# EAGLE schematic XMICRO-MEMORY (EAGLE 6.3)
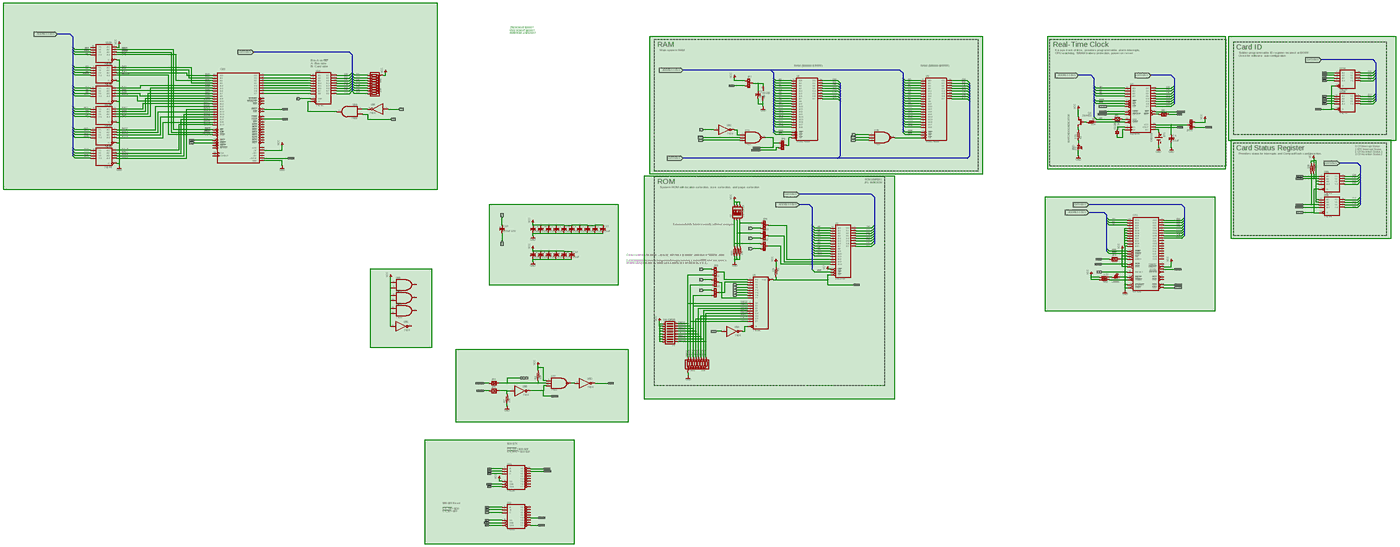
[diagram p0: schematic, sheet 1, overview]
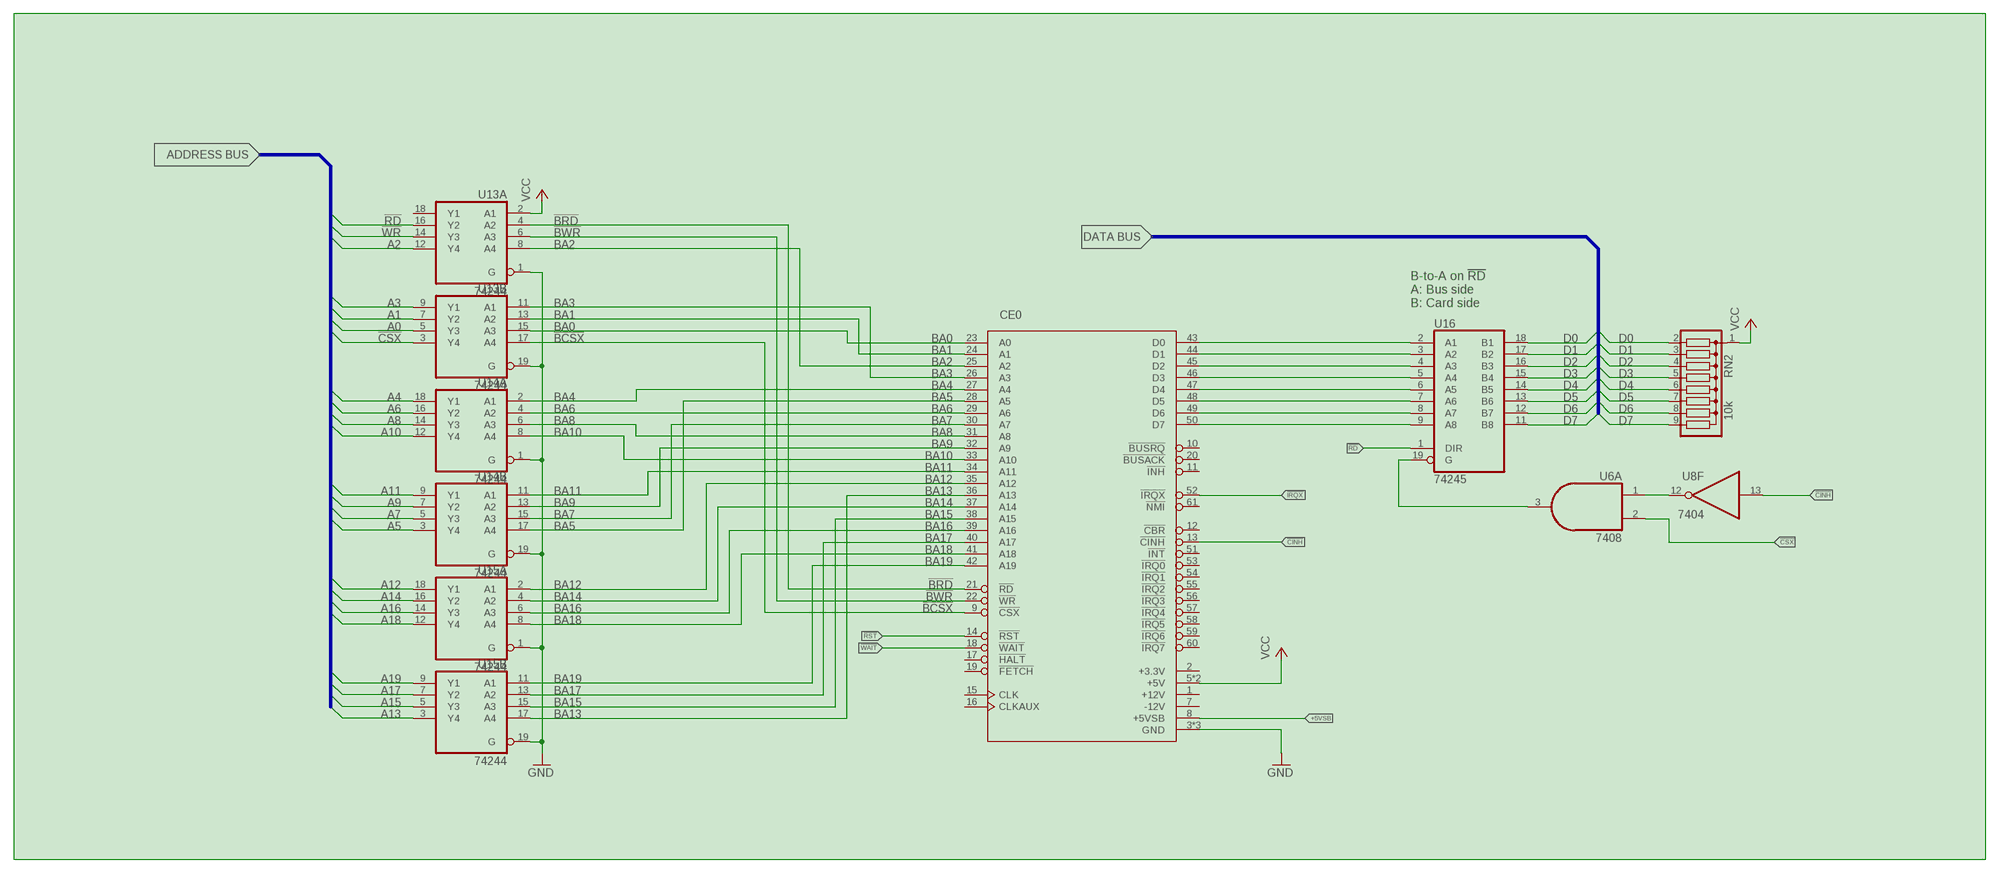
[diagram p1: schematic, sheet 1, part 1 of 6]
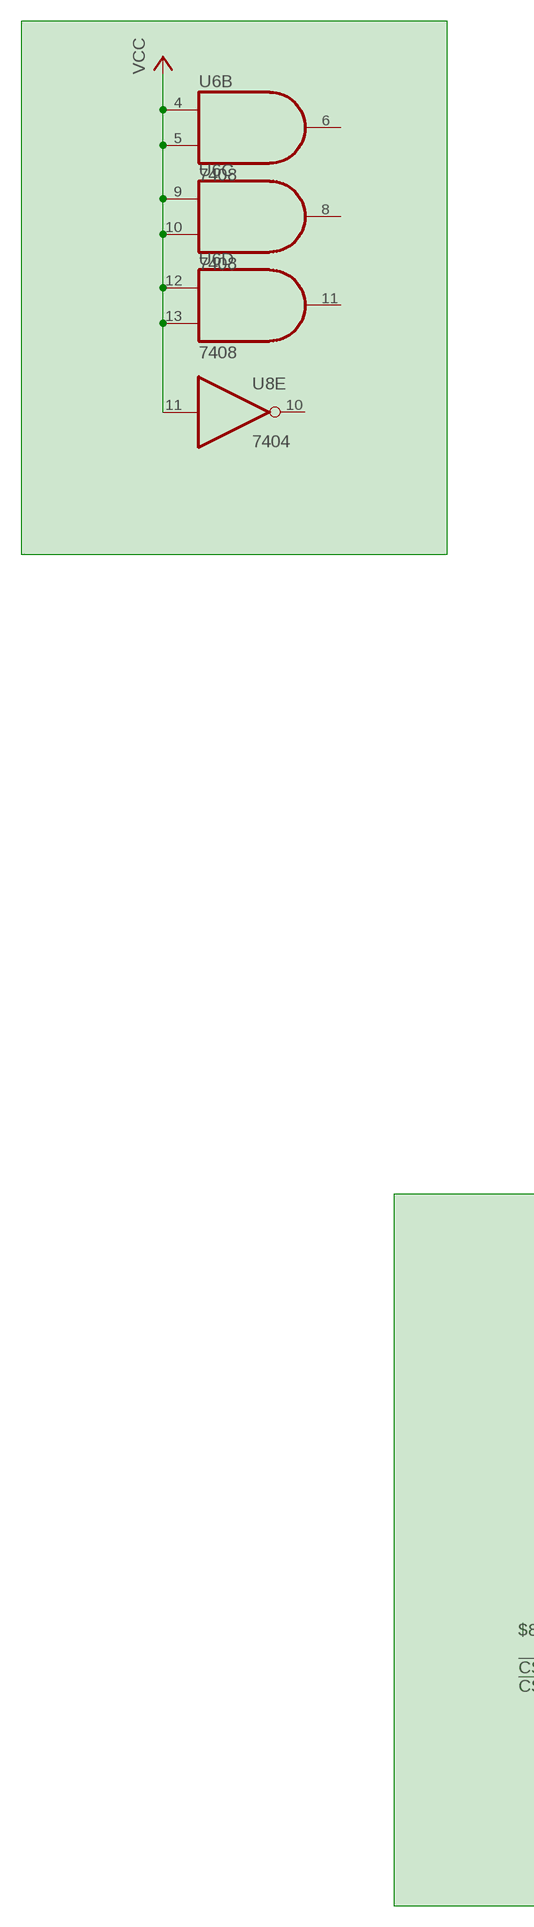
[diagram p2: schematic, sheet 1, part 2 of 6]
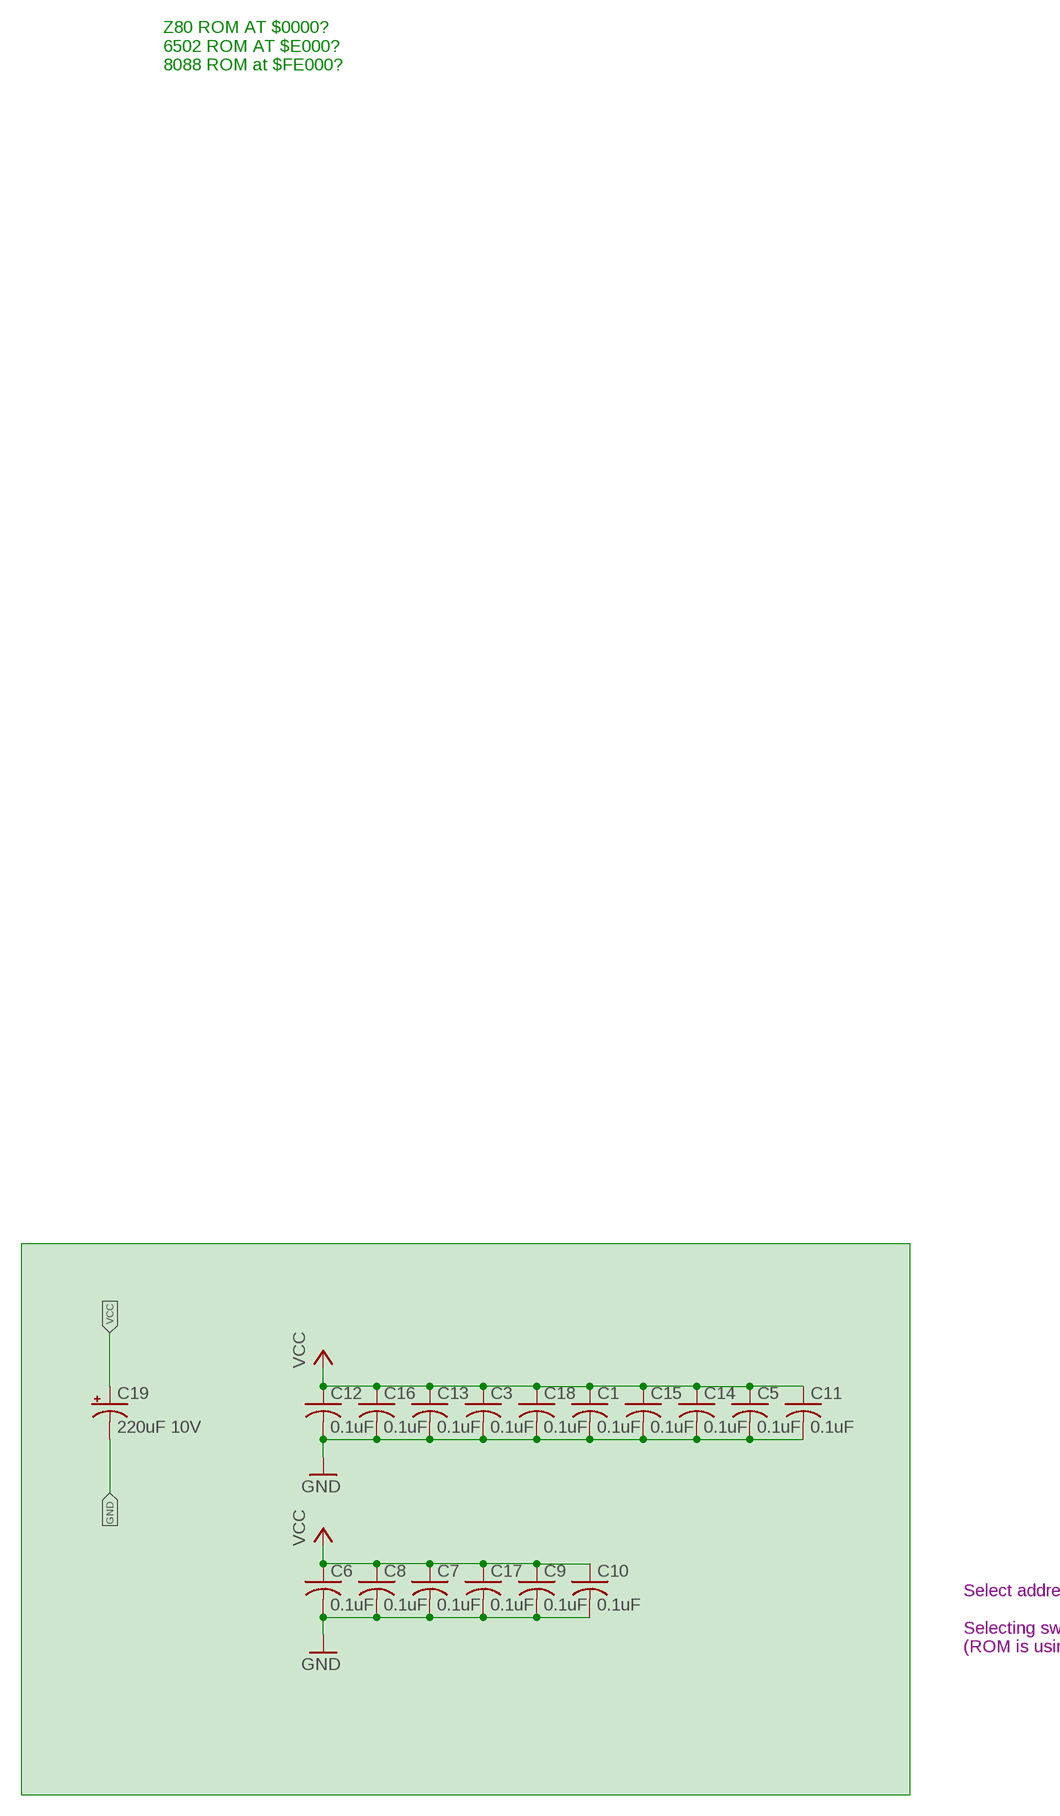
[diagram p3: schematic, sheet 1, part 3 of 6]
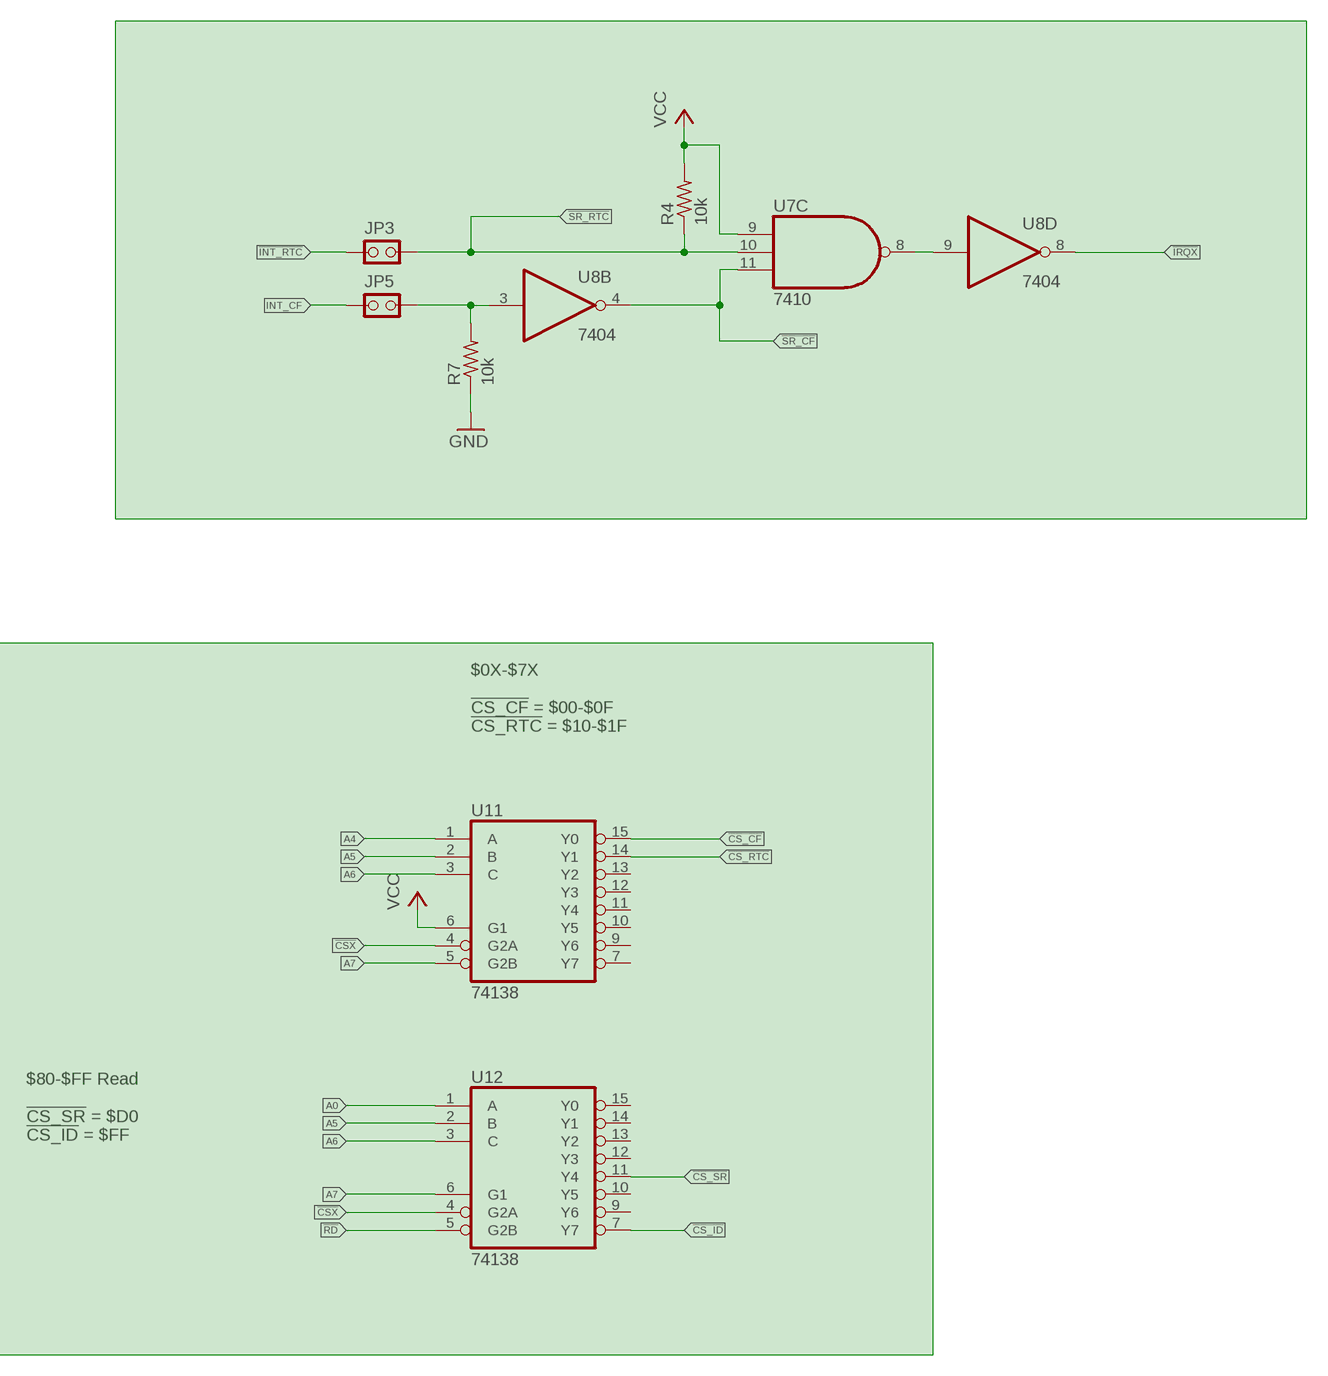
[diagram p4: schematic, sheet 1, part 4 of 6]
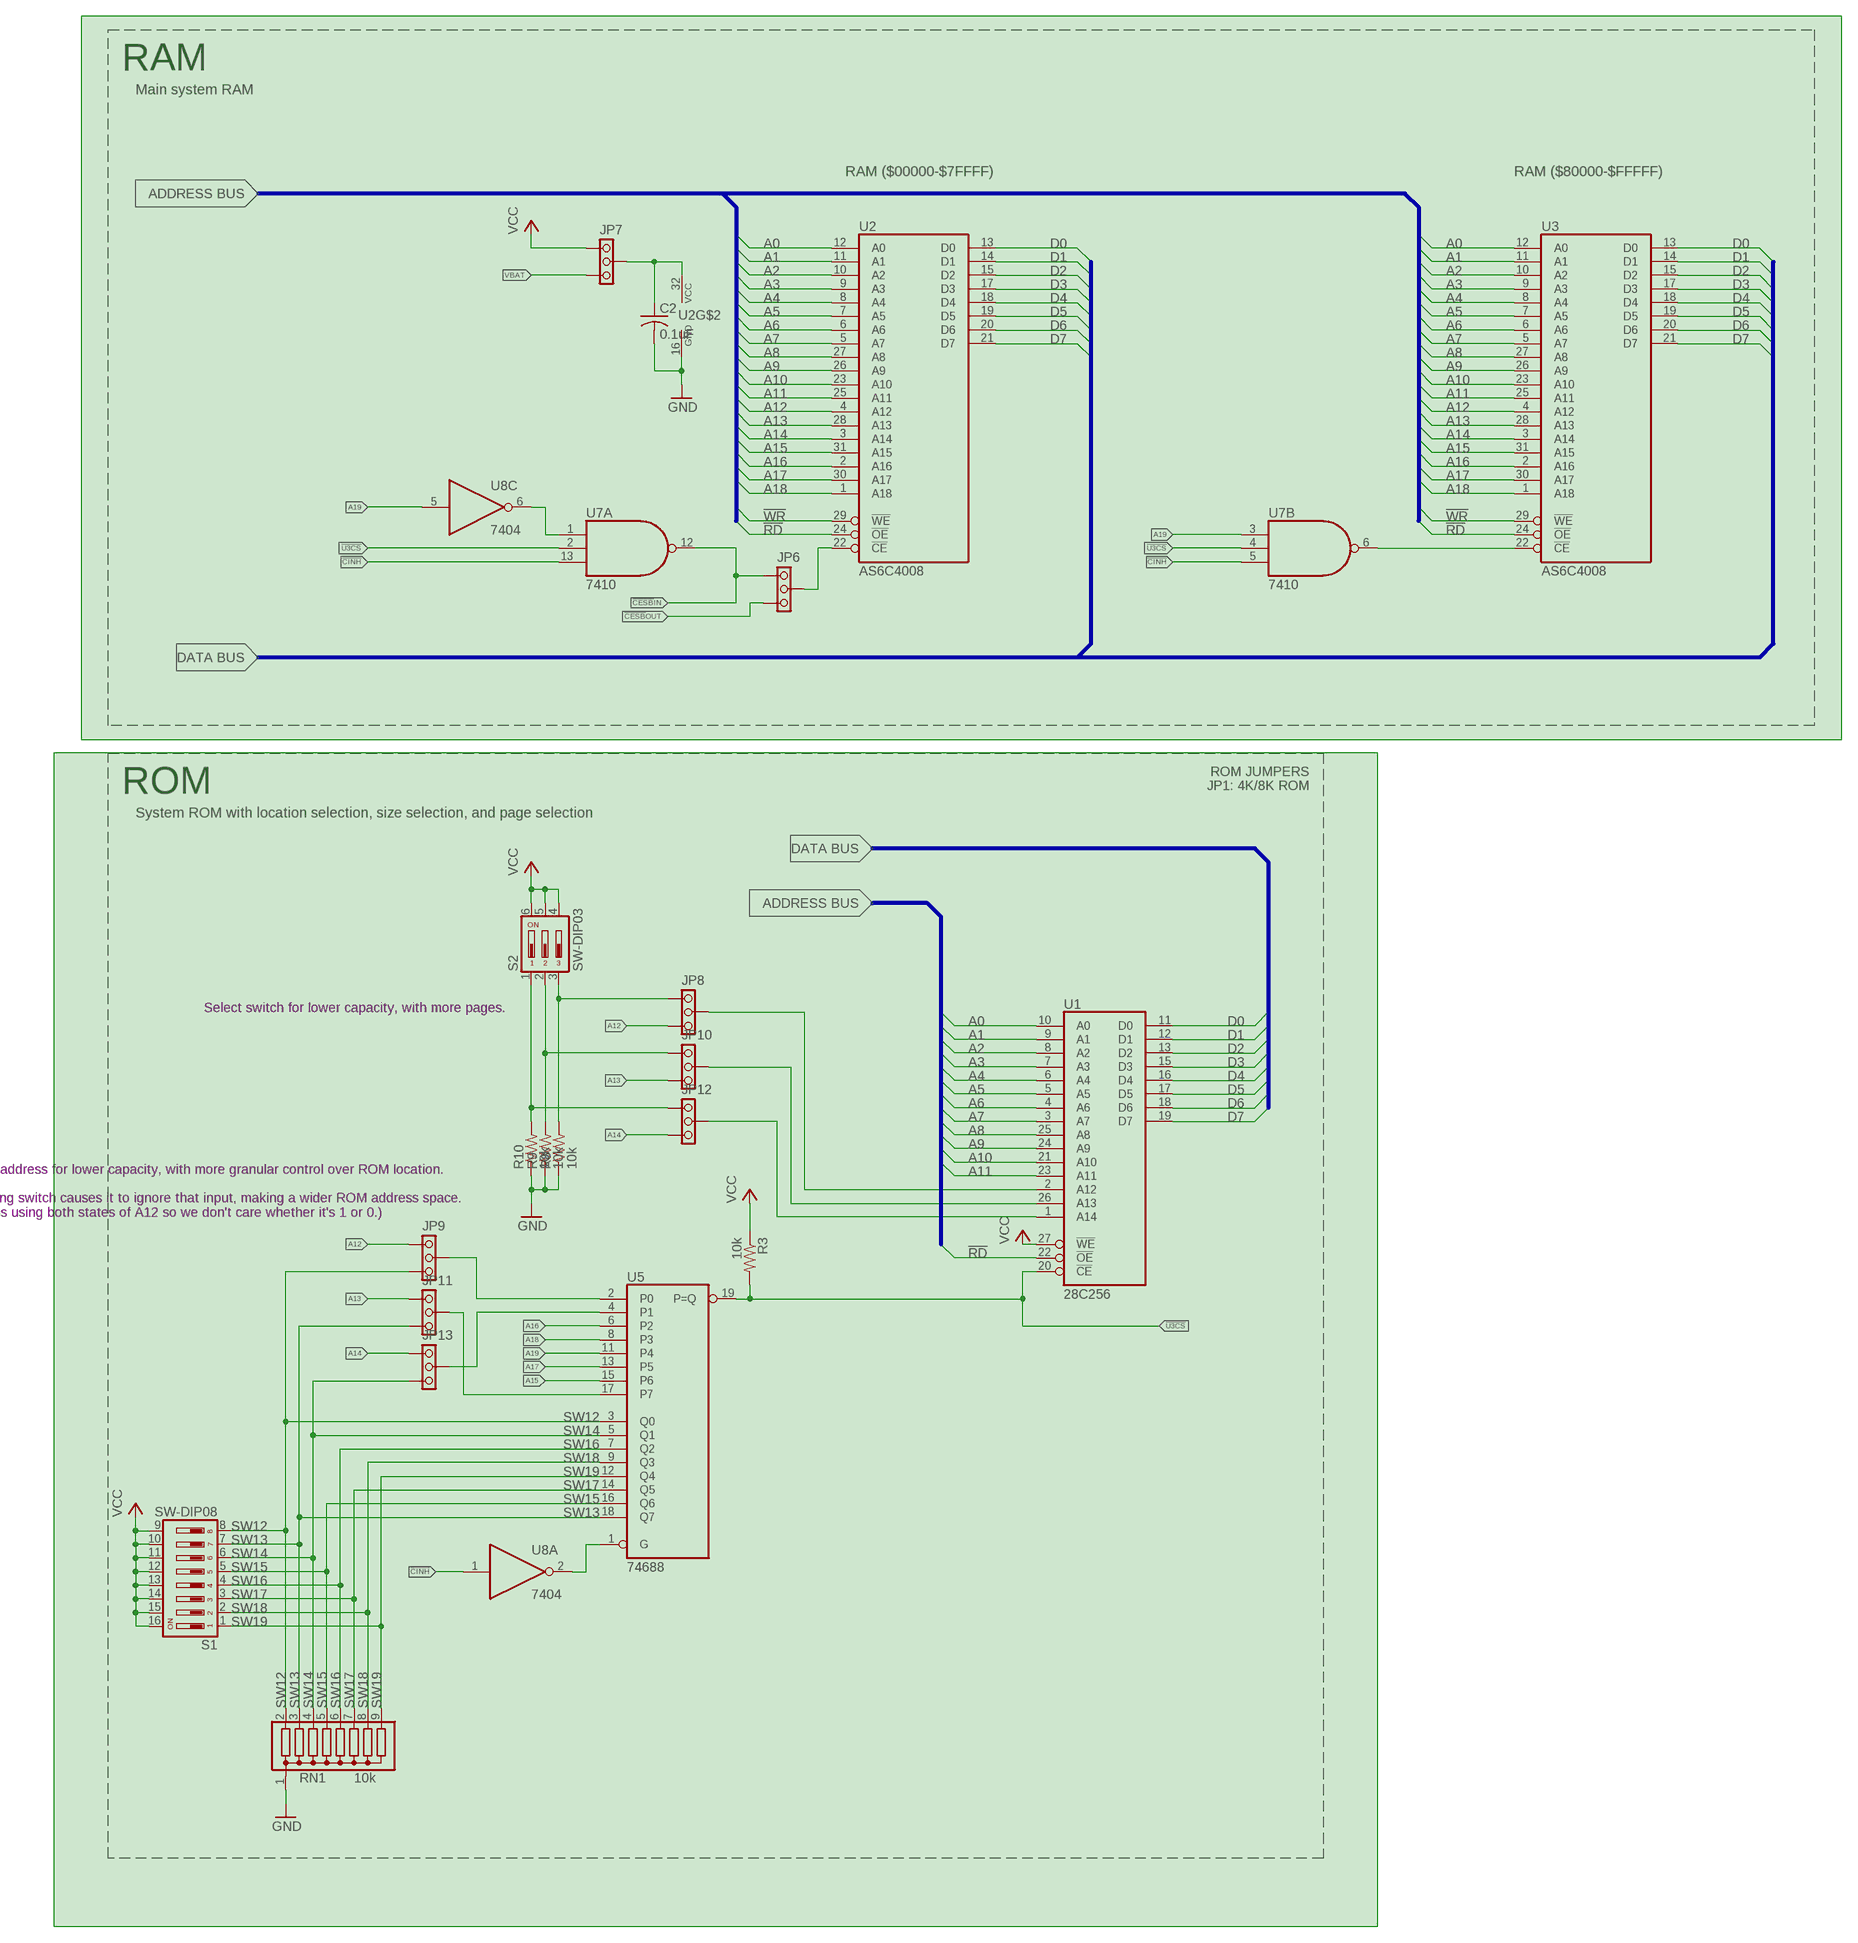
[diagram p5: schematic, sheet 1, part 5 of 6]
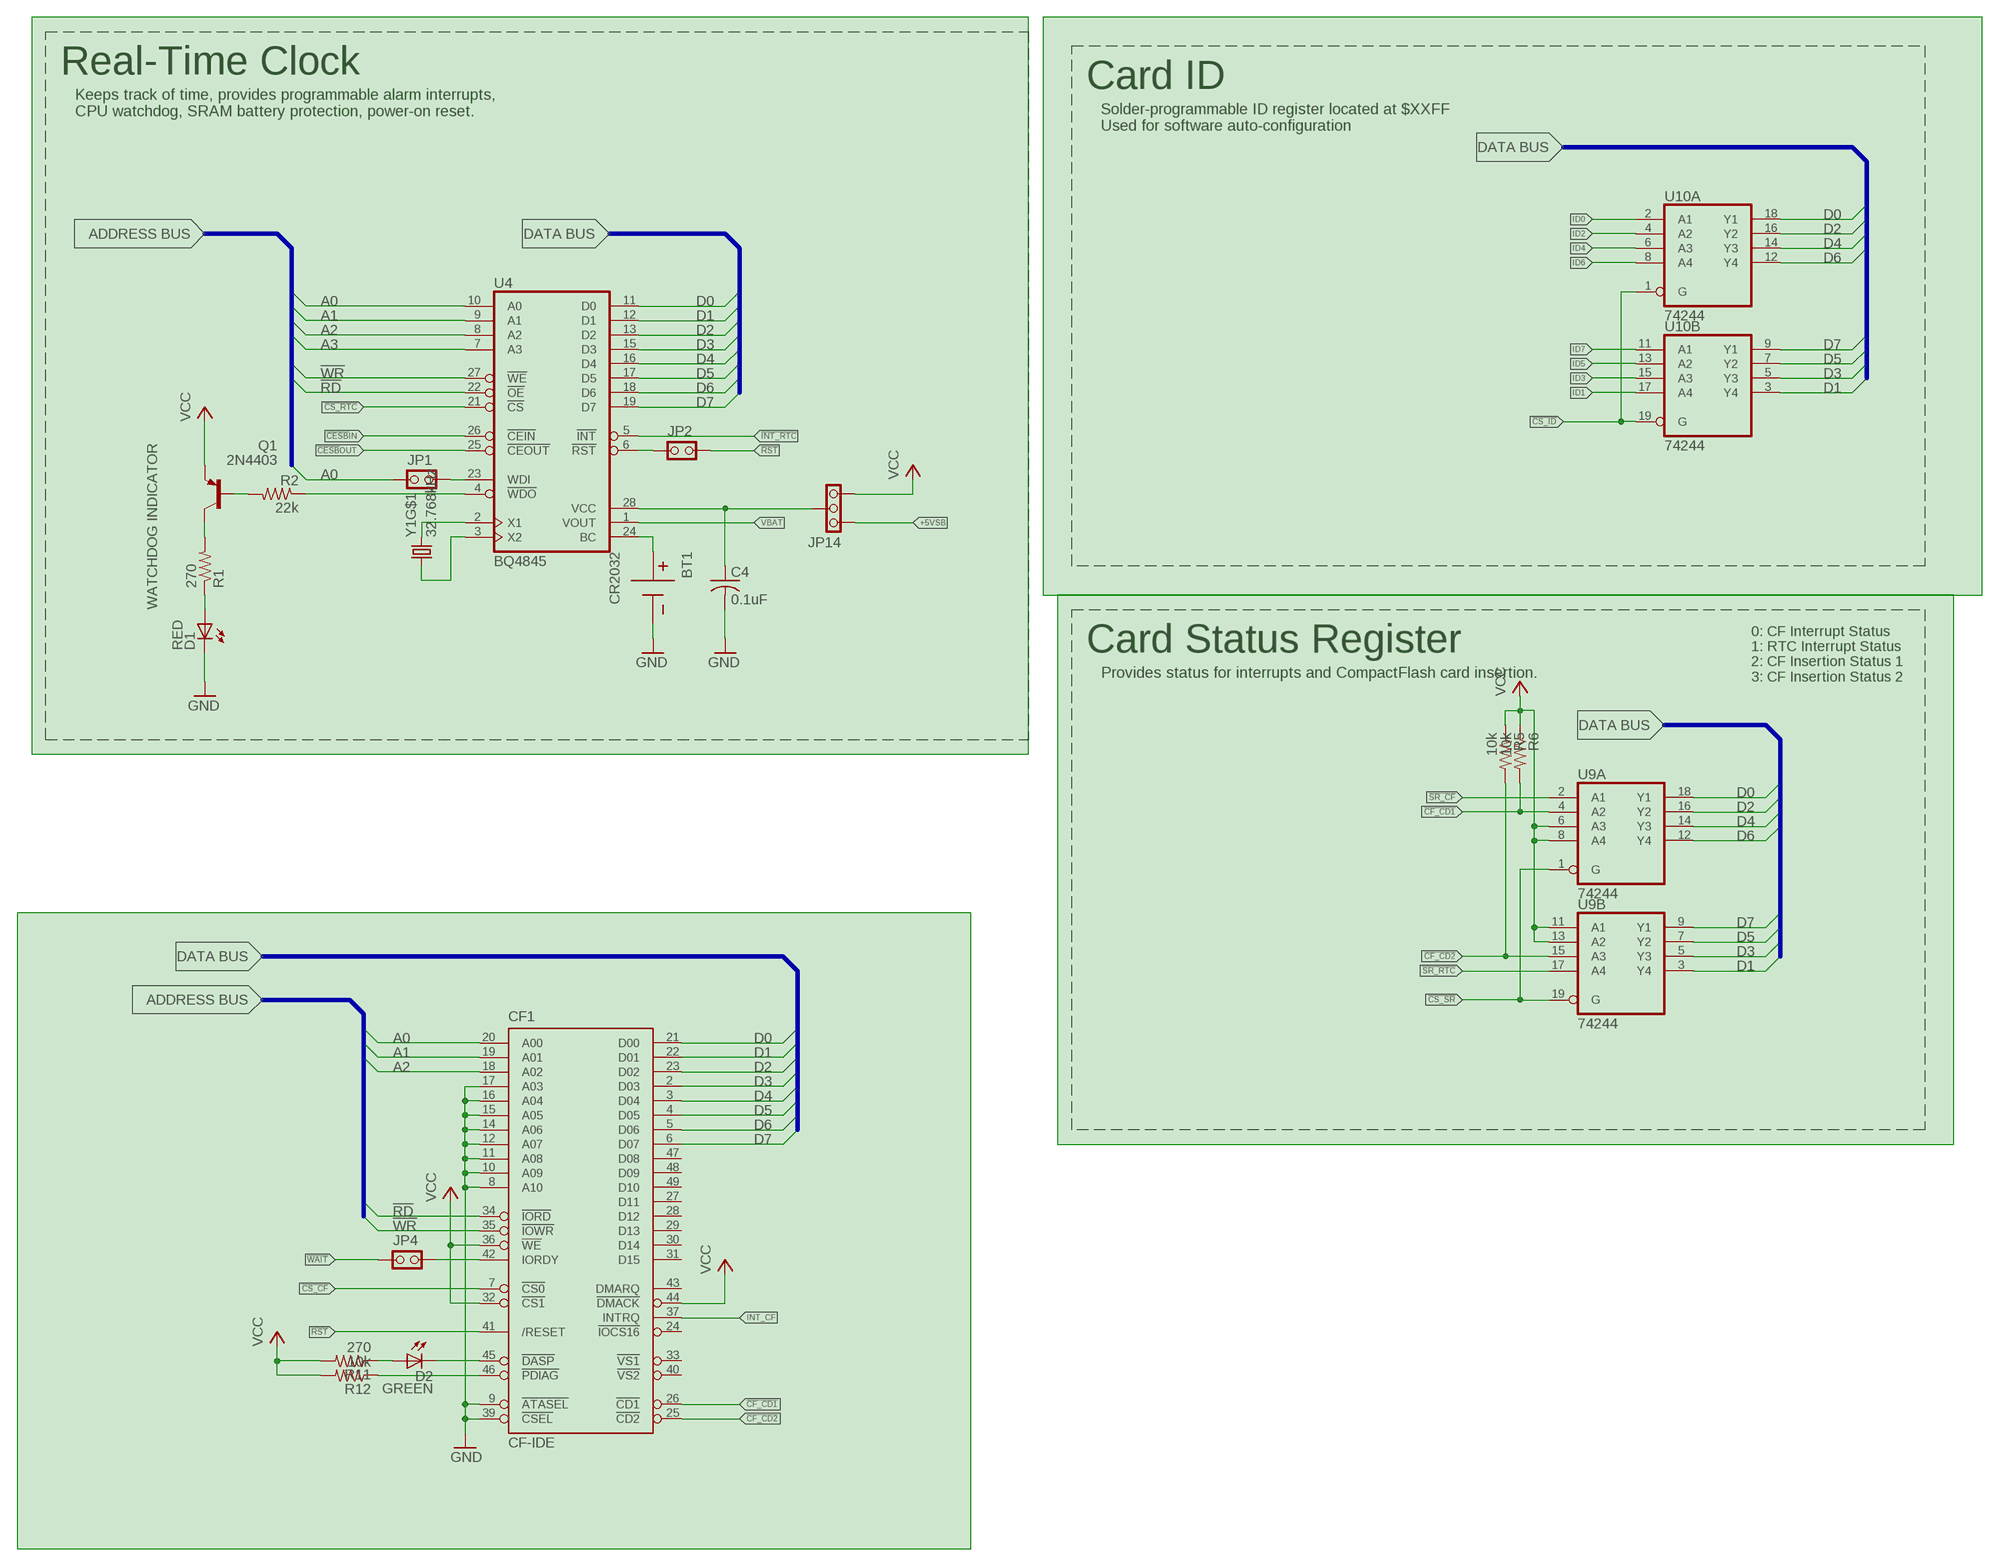
[diagram p6: schematic, sheet 1, part 6 of 6]

## Parts
BT1  CR2032  CR2032SMT  [SMTU2032]
C1  0.1uF  C-US025-024X044  [C025-024X044]
C2  0.1uF  C-US025-024X044  [C025-024X044]
C3  0.1uF  C-US025-024X044  [C025-024X044]
C4  0.1uF  C-US025-024X044  [C025-024X044]
C5  0.1uF  C-US025-024X044  [C025-024X044]
C6  0.1uF  C-US025-024X044  [C025-024X044]
C7  0.1uF  C-US025-024X044  [C025-024X044]
C8  0.1uF  C-US025-024X044  [C025-024X044]
C9  0.1uF  C-US025-024X044  [C025-024X044]
C10  0.1uF  C-US025-024X044  [C025-024X044]
C11  0.1uF  C-US025-024X044  [C025-024X044]
C12  0.1uF  C-US025-024X044  [C025-024X044]
C13  0.1uF  C-US025-024X044  [C025-024X044]
C14  0.1uF  C-US025-024X044  [C025-024X044]
C15  0.1uF  C-US025-024X044  [C025-024X044]
C16  0.1uF  C-US025-024X044  [C025-024X044]
C17  0.1uF  C-US025-024X044  [C025-024X044]
C18  0.1uF  C-US025-024X044  [C025-024X044]
C19  220uF 10V  CPOL-US-10-5  [C-10-5]
CE0  XMICRO-BUS-EDGE62M  [EDGE62M]
CF1  CF-IDE  [CF-KYOCERA]
D1  RED  LED5MM  [LED5MM]
D2  GREEN  LED-3-R  [LED-3-R]
JP1  PINHD-1X2THRU  [1X02]
JP2  PINHD-1X2THRU  [1X02]
JP3  PINHD-1X2THRU  [1X02]
JP4  PINHD-1X2THRU  [1X02]
JP5  PINHD-1X2THRU  [1X02]
JP6  PINHD1X3THRU  [1X03]
JP7  PINHD1X3THRU  [1X03]
JP8  PINHD1X3THRU  [1X03]
JP9  PINHD1X3THRU  [1X03]
JP10  PINHD1X3THRU  [1X03]
JP11  PINHD1X3THRU  [1X03]
JP12  PINHD1X3THRU  [1X03]
JP13  PINHD1X3THRU  [1X03]
JP14  PINHD1X3THRU  [1X03]
Q1  2N4403  TRANSISTOR-PNP-2N4403  [TO92]
R1  270  R-US_0207/10  [0207/10]
R2  22k  R-US_0207/10  [0207/10]
R3  10k  R-US_0207/10  [0207/10]
R4  10k  R-US_0207/10  [0207/10]
R5  10k  R-US_0207/10  [0207/10]
R6  10k  R-US_0207/10  [0207/10]
R7  10k  R-US_0207/10  [0207/10]
R8  10k  R-US_0207/10  [0207/10]
R9  10k  R-US_0207/10  [0207/10]
R10  10k  R-US_0207/10  [0207/10]
R11  270  R-US_0207/10  [0207/10]
R12  10k  R-US_0207/10  [0207/10]
RN1  10k  G08R  [SIL9]
RN2  10k  G08R  [SIL9]
S1  SW-DIP08  [SW-DIP8]
S2  SW-DIP03  [SW-DIP3]
U1  28C256  28256-ZIF28  [228-1277-00]
U2  AS6C4008  4008  [DIL32-6]
U3  AS6C4008  4008  [DIL32-6]
U4  BQ4845  [DIL28]
U5  74688  74LS688N  [DIL20]
U6  7408  74LS08N  [DIL14]
U7  7410  74LS10N  [DIL14]
U8  7404  74LS04N  [DIL14]
U9  74244  74LS244N  [DIL20]
U10  74244  74LS244N  [DIL20]
U11  74138  74LS138N  [DIL16]
U12  74138  74LS138N  [DIL16]
U13  74244  74LS244N  [DIL20]
U14  74244  74LS244N  [DIL20]
U15  74244  74LS244N  [DIL20]
U16  74245  74LS245N  [DIL20]
Y1  32.768kHz  CRYSTAL  [CRYSTAL-3X8H]

## Nets
!BCSX: CE0.9(!CSX) U13.17(B:A4)
!BRD: CE0.21(!RD) U13.4(A:A2)
!BWR: CE0.22(!WR) U13.6(A:A3)
!CESB!IN: JP6.1 U4.26(!CEIN) U7.12(A:O)
!CESB!OUT: JP6.3 U4.25(!CEOUT)
!CF_CD1: CF1.26(!CD1) R6.2 U9.4(A:A2)
!CF_CD2: CF1.25(!CD2) R5.2 U9.15(B:A3)
!CINH: CE0.13(!CINH) U7.5(B:I2) U7.13(A:I2) U8.1(A:I) U8.13(F:I)
!CS_CF: CF1.7(!CS0) U11.15(Y0)
!CS_ID: U10.1(A:G) U10.19(B:G) U12.7(Y7)
!CS_RTC: U4.21(!CS) U11.14(Y1)
!CS_SR: U9.1(A:G) U9.19(B:G) U12.11(Y4)
!CSX: U6.2(A:I1) U11.4(G2A) U12.4(G2A) U13.3(B:Y4)
!INT_RTC: JP3.1 U4.5(!INT)
!IRQX: CE0.52(!IRQX) U8.8(D:O)
!RD: CF1.34(!IORD) U1.22(!OE) U2.24(!OE) U3.24(!OE) U4.22(!OE) U12.5(G2B) U13.16(A:Y2) U16.1(DIR)
!RST: CE0.14(!RST) CF1.41(/RESET) JP2.2
!SR_CF: U7.11(C:I2) U8.4(B:O) U9.2(A:A1)
!SR_RTC: JP3.2 R4.1 U7.10(C:I1) U9.17(B:A4)
!U1CS: JP6.2 U2.22(!CE)
!U2CS: U3.22(!CE) U7.6(B:O)
!U3CS: R3.2 U1.20(!CE) U5.19(P=Q) U7.2(A:I1) U7.4(B:I1)
!WAIT: CE0.18(!WAIT) JP4.1
!WR: CF1.35(!IOWR) U2.29(!WE) U3.29(!WE) U4.27(!WE) U13.14(A:Y3)
+5VSB: CE0.8(+5VSB) JP14.1
A0: CF1.20(A00) JP1.1 U1.10(A0) U2.12(A0) U3.12(A0) U4.10(A0) U12.1(A) U13.5(B:Y3)
A1: CF1.19(A01) U1.9(A1) U2.11(A1) U3.11(A1) U4.9(A1) U13.7(B:Y2)
A2: CF1.18(A02) U1.8(A2) U2.10(A2) U3.10(A2) U4.8(A2) U13.12(A:Y4)
A3: U1.7(A3) U2.9(A3) U3.9(A3) U4.7(A3) U13.9(B:Y1)
A4: U1.6(A4) U2.8(A4) U3.8(A4) U11.1(A) U14.18(A:Y1)
A5: U1.5(A5) U2.7(A5) U3.7(A5) U11.2(B) U12.2(B) U14.3(B:Y4)
A6: U1.4(A6) U2.6(A6) U3.6(A6) U11.3(C) U12.3(C) U14.16(A:Y2)
A7: U1.3(A7) U2.5(A7) U3.5(A7) U11.5(G2B) U12.6(G1) U14.5(B:Y3)
A8: U1.25(A8) U2.27(A8) U3.27(A8) U14.14(A:Y3)
A9: U1.24(A9) U2.26(A9) U3.26(A9) U14.7(B:Y2)
A10: U1.21(A10) U2.23(A10) U3.23(A10) U14.12(A:Y4)
A11: U1.23(A11) U2.25(A11) U3.25(A11) U14.9(B:Y1)
A12: JP8.3 JP9.1 U2.4(A12) U3.4(A12) U15.18(A:Y1)
A13: JP10.3 JP11.1 U2.28(A13) U3.28(A13) U15.3(B:Y4)
A14: JP12.3 JP13.1 U2.3(A14) U3.3(A14) U15.16(A:Y2)
A15: U2.31(A15) U3.31(A15) U5.15(P6) U15.5(B:Y3)
A16: U2.2(A16) U3.2(A16) U5.6(P2) U15.14(A:Y3)
A17: U2.30(A17) U3.30(A17) U5.13(P5) U15.7(B:Y2)
A18: U2.1(A18) U3.1(A18) U5.8(P3) U15.12(A:Y4)
A19: U5.11(P4) U7.3(B:I0) U8.5(C:I) U15.9(B:Y1)
BA0: CE0.23(A0) U13.15(B:A3)
BA1: CE0.24(A1) U13.13(B:A2)
BA2: CE0.25(A2) U13.8(A:A4)
BA3: CE0.26(A3) U13.11(B:A1)
BA4: CE0.27(A4) U14.2(A:A1)
BA5: CE0.28(A5) U14.17(B:A4)
BA6: CE0.29(A6) U14.4(A:A2)
BA7: CE0.30(A7) U14.15(B:A3)
BA8: CE0.31(A8) U14.6(A:A3)
BA9: CE0.32(A9) U14.13(B:A2)
BA10: CE0.33(A10) U14.8(A:A4)
BA11: CE0.34(A11) U14.11(B:A1)
BA12: CE0.35(A12) U15.2(A:A1)
BA13: CE0.36(A13) U15.17(B:A4)
BA14: CE0.37(A14) U15.4(A:A2)
BA15: CE0.38(A15) U15.15(B:A3)
BA16: CE0.39(A16) U15.6(A:A3)
BA17: CE0.40(A17) U15.13(B:A2)
BA18: CE0.41(A18) U15.8(A:A4)
BA19: CE0.42(A19) U15.11(B:A1)
D0: CF1.21(D00) RN2.2 U1.11(D0) U2.13(D0) U3.13(D0) U4.11(D0) U9.18(A:Y1) U10.18(A:Y1) U16.18(B1)
D1: CF1.22(D01) RN2.3 U1.12(D1) U2.14(D1) U3.14(D1) U4.12(D1) U9.3(B:Y4) U10.3(B:Y4) U16.17(B2)
D2: CF1.23(D02) RN2.4 U1.13(D2) U2.15(D2) U3.15(D2) U4.13(D2) U9.16(A:Y2) U10.16(A:Y2) U16.16(B3)
D3: CF1.2(D03) RN2.5 U1.15(D3) U2.17(D3) U3.17(D3) U4.15(D3) U9.5(B:Y3) U10.5(B:Y3) U16.15(B4)
D4: CF1.3(D04) RN2.6 U1.16(D4) U2.18(D4) U3.18(D4) U4.16(D4) U9.14(A:Y3) U10.14(A:Y3) U16.14(B5)
D5: CF1.4(D05) RN2.7 U1.17(D5) U2.19(D5) U3.19(D5) U4.17(D5) U9.7(B:Y2) U10.7(B:Y2) U16.13(B6)
D6: CF1.5(D06) RN2.8 U1.18(D6) U2.20(D6) U3.20(D6) U4.18(D6) U9.12(A:Y4) U10.12(A:Y4) U16.12(B7)
D7: CF1.6(D07) RN2.9 U1.19(D7) U2.21(D7) U3.21(D7) U4.19(D7) U9.9(B:Y1) U10.9(B:Y1) U16.11(B8)
GND [GND]: BT1.- C1.2 C2.2 C3.2 C4.2 C5.2 C6.2 C7.2 C8.2 C9.2 C10.2 C11.2 C12.2 C13.2 C14.2 C15.2 C16.2 C17.2 C18.2 C19.- CE0.3(GND) CE0.4(GND) CE0.62(GND) CF1.8(A10) CF1.9(!ATASEL) CF1.10(A09) CF1.11(A08) CF1.12(A07) CF1.14(A06) CF1.15(A05) CF1.16(A04) CF1.17(A03) CF1.39(!CSEL) D1.K(C) R7.1 R8.1 R9.1 R10.1 RN1.1 U2.16(GND) U13.1(A:G) U13.19(B:G) U14.1(A:G) U14.19(B:G) U15.1(A:G) U15.19(B:G)
ID0: U10.2(A:A1)
ID1: U10.17(B:A4)
ID2: U10.4(A:A2)
ID3: U10.15(B:A3)
ID4: U10.6(A:A3)
ID5: U10.13(B:A2)
ID6: U10.8(A:A4)
ID7: U10.11(B:A1)
INT_CF: CF1.37(INTRQ) JP5.1
N$1: CF1.45(!DASP) D2.C
N$2: D2.A R11.1
N$3: CF1.42(IORDY) JP4.2
N$4: U5.1(G) U8.2(A:O)
N$5: U4.3(X2) Y1.1
N$6: U4.2(X1) Y1.2
N$7: BT1.+ U4.24(BC)
N$8: Q1.2(B) R2.2
N$9: C2.1 JP7.2 U2.32(VCC)
N$10: Q1.3(C) R1.2
N$11: JP1.2 U4.23(WDI)
N$12: JP10.2 U1.26(A13)
N$13: D1.A R1.1
N$14: R2.1 U4.4(!WDO)
N$16: JP8.2 U1.2(A12)
N$17: JP12.2 U1.1(A14)
N$18: JP13.2 U5.4(P1)
N$19: U7.8(C:O) U8.9(D:I)
N$20: U6.1(A:I0) U8.12(F:O)
N$21: JP5.2 R7.2 U8.3(B:I)
N$22: JP11.2 U5.17(P7)
N$23: JP9.2 U5.2(P0)
N$24: C4.1 JP14.2 U4.28(VCC)
N$25: CF1.46(!PDIAG) R12.1
N$27: U7.1(A:I0) U8.6(C:O)
N$31: JP2.1 U4.6(!RST)
N$32: U6.3(A:O) U16.19(G)
N$33: CE0.50(D7) U16.9(A8)
N$34: CE0.49(D6) U16.8(A7)
N$35: CE0.48(D5) U16.7(A6)
N$36: CE0.47(D4) U16.6(A5)
N$37: CE0.46(D3) U16.5(A4)
N$38: CE0.45(D2) U16.4(A3)
N$39: CE0.44(D1) U16.3(A2)
N$40: CE0.43(D0) U16.2(A1)
N$108: JP8.1 R8.2 S2.3
N$109: JP10.1 R9.2 S2.2
N$110: JP12.1 R10.2 S2.1
SW12: JP9.3 RN1.2 S1.8 U5.3(Q0)
SW13: JP11.3 RN1.3 S1.7 U5.18(Q7)
SW14: JP13.3 RN1.4 S1.6 U5.5(Q1)
SW15: RN1.5 S1.5 U5.16(Q6)
SW16: RN1.6 S1.4 U5.7(Q2)
SW17: RN1.7 S1.3 U5.14(Q5)
SW18: RN1.8 S1.2 U5.9(Q3)
SW19: RN1.9 S1.1 U5.12(Q4)
VBAT: JP7.3 U4.1(VOUT)
VCC: C1.1 C3.1 C5.1 C6.1 C7.1 C8.1 C9.1 C10.1 C11.1 C12.1 C13.1 C14.1 C15.1 C16.1 C17.1 C18.1 C19.+ CE0.5(+5V) CE0.6(+5V) CF1.32(!CS1) CF1.36(!WE) CF1.44(!DMACK) JP7.1 JP14.3 Q1.1(E) R3.1 R4.2 R5.1 R6.1 R11.2 R12.2 RN2.1 S1.9 S1.10 S1.11 S1.12 S1.13 S1.14 S1.15 S1.16 S2.4 S2.5 S2.6 U1.27(!WE) U6.4(B:I0) U6.5(B:I1) U6.9(C:I0) U6.10(C:I1) U6.12(D:I0) U6.13(D:I1) U7.9(C:I0) U8.11(E:I) U9.6(A:A3) U9.8(A:A4) U9.11(B:A1) U9.13(B:A2) U11.6(G1) U13.2(A:A1)
Unconnected: CE0.1(+12V) CE0.2(+3.3V) CE0.7(-12V) CE0.10(!BUSRQ) CE0.11(!INH) CE0.12(!CBR) CE0.15(CLK) CE0.16(CLKAUX) CE0.17(!HALT) CE0.19(!FETCH) CE0.20(!BUSACK) CE0.51(!INT) CE0.53(!IRQ0) CE0.54(!IRQ1) CE0.55(!IRQ2) CE0.56(!IRQ3) CE0.57(!IRQ4) CE0.58(!IRQ5) CE0.59(!IRQ6) CE0.60(!IRQ7) CE0.61(!NMI) CF1.24(!IOCS16) CF1.27(D11) CF1.28(D12) CF1.29(D13) CF1.30(D14) CF1.31(D15) CF1.33(!VS1) CF1.40(!VS2) CF1.43(DMARQ) CF1.47(D08) CF1.48(D09) CF1.49(D10) U6.6(B:O) U6.8(C:O) U6.11(D:O) U8.10(E:O) U11.7(Y7) U11.9(Y6) U11.10(Y5) U11.11(Y4) U11.12(Y3) U11.13(Y2) U12.9(Y6) U12.10(Y5) U12.12(Y3) U12.13(Y2) U12.14(Y1) U12.15(Y0) U13.18(A:Y1)

## Buses
D[0..7]
A[0..19],!RD,!WR,!CSX

## Notes on the sheet
- 20-37
- 10-18
- 33-60
- 53-100
- ADDRESS BUS
- Z80 ROM AT $0000?
  6502 ROM AT $E000?
  8088 ROM at $FE000?
- RAM | Real-Time Clock
- Card ID
- Main system RAM
- Keeps track of time, provides programmable alarm interrupts,
  CPU watchdog, SRAM battery protection, power-on reset.
- DATA BUS
- Solder-programmable ID register located at $XXFF
  Used for software auto-configuration
- 75-92 | DATA BUS
- 85ns bank switch
  20ns extra for A19
  55ns RAM
  160ns max RAM access time.
- 50ns from !RD!/!WR! | RAM ($00000-$7FFFF) | RAM ($80000-$FFFFF)
- B-to-A on !RD!
  A: Bus side
  B: Card side
- ADDRESS BUS
- ADDRESS BUS | DATA BUS
- Max 85.5ns from PH0=1
- 55 | 55 | 9-12
- 8
- WATCHDOG INDICATOR
- Card Status Register
- Provides status for interrupts and CompactFlash card insertion.
- 0: CF Interrupt Status
  1: RTC Interrupt Status
  2: CF Insertion Status 1
  3: CF Insertion Status 2
- DATA BUS
- DATA BUS
- ROM
- ROM JUMPERS
  JP1: 4K/8K ROM
- Max 85ns for bank switch
- 14ns for comparator
- 150ns for ROM | System ROM with location selection, size selection, and page selection
- DATA BUS
- =249ns max ROM access time.
  Should probably still work, but dangerously close.
  Unlikely to do a bank switch into ROM, but it must be considered.
- 164
- 70ns from !RD | ADDRESS BUS | DATA BUS
- Max 105.5ns from PH0=1 | ADDRESS BUS
- Select switch for lower capacity, with more pages.
- 150
- Select address for lower capacity, with more granular control over ROM location.
  
  Selecting switch causes it to ignore that input, making a wider ROM address space.
  (ROM is using both states of A12 so we don't care whether it's 1 or 0.)
- 14
- $0X-$7X
  
  !CS_CF! = $00-$0F
  !CS_RTC! = $10-$1F
- $80-$FF Read
  
  !CS_SR! = $D0
  !CS_ID! = $FF

## Power pins joined to a net without a drawn wire
GND: CF1.1(GND) CF1.50(GND) CF1.P$51(GND) CF1.P$52(GND) U1.14(GND) U3.16(GND) U4.14(GND) U4.20(GND) U5.10(GND) U6.7(P:GND) U7.7(P:GND) U8.7(P:GND) U9.10(P:GND) U10.10(P:GND) U11.8(GND) U12.8(GND) U13.10(P:GND) U14.10(P:GND) U15.10(P:GND) U16.10(GND) Y1.P$1(GND)
VCC: CF1.13(VCC) CF1.38(VCC) U1.28(VCC) U3.32(VCC) U5.20(VCC) U6.14(P:VCC) U7.14(P:VCC) U8.14(P:VCC) U9.20(P:VCC) U10.20(P:VCC) U11.16(VCC) U12.16(VCC) U13.20(P:VCC) U14.20(P:VCC) U15.20(P:VCC) U16.20(VCC)

## Library data of the parts
BT1 = Custom:CR2032
C1-C18 = resistor:C-US: CAPACITOR, American symbol
C19 = Custom:CPOL-US
CE0 = Custom:XMICRO-BUS
CF1 = Custom:CF-IDE
D1 = led:LED: LED OSRAM: - CHIPLED LG R971, LG N971, LY N971, LG Q971, LY Q971, LO R971, LY R971 LH N974, LH R974 LS Q976, LO Q976, LY Q976 LO Q996 - Hyper CHIPLED LW Q18S LB Q993, LB Q99A, LB R99A - SideLED LS A670, LO A670, LY A670, LG A670, LP A670 LB A673, LV A673, LT A673, LW A673 LH A674 LY A675 LS A676, LA A676, LO A676, LY A676, LW A676 LS A679, LY A679, LG A679 - Hyper Micro SIDELED® LS Y876, LA Y876, LO Y876, LY Y876 LT Y87S - SmartLED LW L88C, LW L88S LB L89C, LB L89S, LG L890 LS L89K, LO L89K, LY L89K LS L896, LA L896, LO L896, LY L896 - TOPLED LS T670, LO T670, LY T670, LG T670, LP T670 LSG T670, LSP T670, LSY T670, LOP T670, LYG T670 LG T671, LOG T671, LSG T671 LB T673, LV T673, LT T673, LW T673 LH T674 LS T676, LA T676, LO T676, LY T676, LB T676, LH T676, LSB T676, LW T676 LB T67C, LV T67C, LT T67C, LS T67K, LO T67K, LY T67K, LW E67C LS E67B, LA E67B, LO E67B, LY E67B, LB E67C, LV E67C, LT E67C LW T67C LS T679, LY T679, LG T679 LS T770, LO T770, LY T770, LG T770, LP T770 LB T773, LV T773, LT T773, LW T773 LH T774 LS E675, LA E675, LY E675, LS T675 LS T776, LA T776, LO T776, LY T776, LB T776 LHGB T686 LT T68C, LB T68C - Hyper Mini TOPLED® LB M676 - Mini TOPLED Santana® LG M470 LS M47K, LO M47K, LY M47K Source: http://www.osram.convergy.de LUXEON: - LUMILED® LXK2-PW12-R00, LXK2-PW12-S00, LXK2-PW14-U00, LXK2-PW14-V00 LXK2-PM12-R00, LXK2-PM12-S00, LXK2-PM14-U00 LXK2-PE12-Q00, LXK2-PE12-R00, LXK2-PE12-S00, LXK2-PE14-T00, LXK2-PE14-U00 LXK2-PB12-K00, LXK2-PB12-L00, LXK2-PB12-M00, LXK2-PB14-N00, LXK2-PB14-P00, LXK2-PB14-Q00 LXK2-PR12-L00, LXK2-PR12-M00, LXK2-PR14-Q00, LXK2-PR14-R00 LXK2-PD12-Q00, LXK2-PD12-R00, LXK2-PD12-S00 LXK2-PH12-R00, LXK2-PH12-S00 LXK2-PL12-P00, LXK2-PL12-Q00, LXK2-PL12-R00 Source: www.luxeon.com KINGBRIGHT: KA-3528ASYC Source: www.kingbright.com
D2 = Custom:LED: 3mm Right-angle LED
JP1-JP5 = Custom:PINHD-1X2THRU
JP6-JP14 = Custom:PINHD1X3THRU
Q1 = Custom:TRANSISTOR-PNP
R1-R12 = resistor:R-US_: RESISTOR, American symbol
RN1 RN2 = resistor-sil:G08R: SIL RESISTOR; OC_FARNELL: unknown; OC_NEWARK: unknown
S1 = Custom:SW-DIP08
S2 = Custom:SW-DIP03
U1 = Custom:28256: 28C256 Parallel EEPROM
U2 U3 = Custom:4008
U4 = Custom:BQ4845
U5 = 74xx-us:74*688: 8-bit MAGNITUDE/IDENTITY COMPARATOR, totem pole
U6 = 74xx-us:74*08: Quad 2-input AND gate
U7 = 74xx-us:74*10: Triple 3-input NAND gate
U8 = 74xx-us:74*04: Hex INVERTER
U9 U10 U13-U15 = 74xx-us:74*244: Octal BUFFER and LINE DRIVER, 3-state
U11 U12 = 74xx-us:74*138: 3-line to 8-line DECODER/DEMULTIPLEXER
U16 = 74xx-us:74*245: Octal BUS TRANSCEIVER, 3-state
Y1 = Custom:CRYSTAL

## Net classes
1 GND: width 0.254 mm, clearance 0.305 mm